# Altium schematic sheet IO.SchDoc
size A4; SheetNumber: 3; SheetTotal: 7
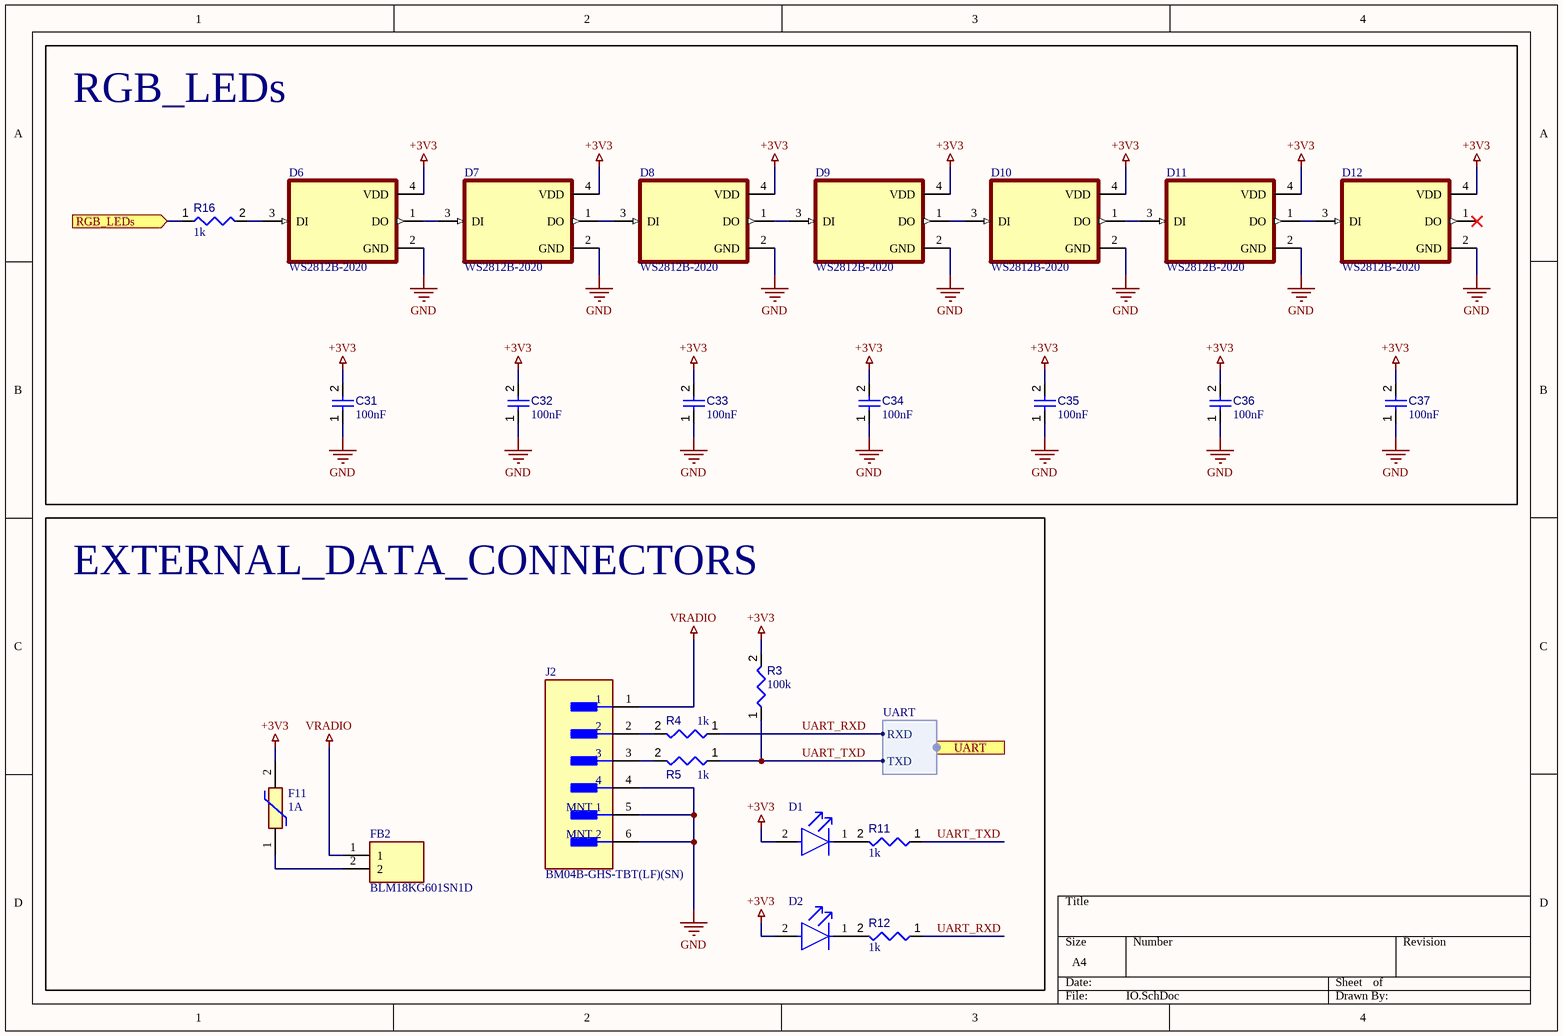
[diagram p0: IO.SchDoc]

## Parts
C31  value 100nF  [CAPC0402(1005)60_L]  (hidden comment: Capacitor 100nF +/-20% 10V 0402)
C32  value 100nF  [CAPC0402(1005)60_L]  (hidden comment: Capacitor 100nF +/-20% 10V 0402)
C33  value 100nF  [CAPC0402(1005)60_L]  (hidden comment: Capacitor 100nF +/-20% 10V 0402)
C34  value 100nF  [CAPC0402(1005)60_L]  (hidden comment: Capacitor 100nF +/-20% 10V 0402)
C35  value 100nF  [CAPC0402(1005)60_L]  (hidden comment: Capacitor 100nF +/-20% 10V 0402)
C36  value 100nF  [CAPC0402(1005)60_L]  (hidden comment: Capacitor 100nF +/-20% 10V 0402)
C37  value 100nF  [CAPC0402(1005)60_L]  (hidden comment: Capacitor 100nF +/-20% 10V 0402)
D1  (no value)  [FP-LTST-C191TBKT-MFG]
D2  (no value)  [FP-LTST-C191TBKT-MFG]
D6  WS2812B-2020  [LED_WS2812-2020]
D7  WS2812B-2020  [LED_WS2812-2020]
D8  WS2812B-2020  [LED_WS2812-2020]
D9  WS2812B-2020  [LED_WS2812-2020]
D10  WS2812B-2020  [LED_WS2812-2020]
D11  WS2812B-2020  [LED_WS2812-2020]
D12  WS2812B-2020  [LED_WS2812-2020]
F11  1A  [0402L010SLKR]
FB2  BLM18KG601SN1D  [BLM18EG121SH1D]
J2  BM04B-GHS-TBT(LF)(SN)  [FP-BM04B-GHS-TBT_LF_SN-MFG]
R3  value 100k  [RESC0402(1005)_L]  (hidden comment: Resistor 100K +/-1 % 0402 63 mW)
R4  value 1k  [RESC0402(1005)_L]  (hidden comment: Resistor 1K +/-5 % 0402 63 mW)
R5  value 1k  [RESC0402(1005)_L]  (hidden comment: Resistor 1K +/-5 % 0402 63 mW)
R11  value 1k  [RESC0402(1005)_L]  (hidden comment: Resistor 1K +/-5 % 0402 63 mW)
R12  value 1k  [RESC0402(1005)_L]  (hidden comment: Resistor 1K +/-5 % 0402 63 mW)
R16  value 1k  [RESC0402(1005)_L]  (hidden comment: Resistor 1K +/-5 % 0402 63 mW)

## Blocks framed on the sheet
RGB_LEDs: C31-C37 D6-D12 R16
EXTERNAL_DATA_CONNECTORS: D1 D2 F11 FB2 J2 R3-R5 R11 R12

## Ports
RGB_LEDs (in, see MAIN_BOARD[2B], MCU[3B]), UART (harness UART, see MAIN_BOARD[2C], MCU[3B])

## Harnesses
UART: RXD, TXD

## Nets
+3V3: C31.2 C32.2 C33.2 C34.2 C35.2 C36.2 C37.2 D1.2(A) D2.2(A) D6.4(VDD) D7.4(VDD) D8.4(VDD) D9.4(VDD) D10.4(VDD) D11.4(VDD) D12.4(VDD) F11.2 R3.2
GND: C31.1 C32.1 C33.1 C34.1 C35.1 C36.1 C37.1 D6.2(GND) D7.2(GND) D8.2(GND) D9.2(GND) D10.2(GND) D11.2(GND) D12.2(GND) J2.4 J2.5(MNT_1) J2.6(MNT_2)
VRADIO: FB2.1 J2.1
RGB_LEDs: R16.1 ; port RGB_LEDs
UART_RXD: R4.1 R12.1 ; port UART.RXD
UART_TXD: R3.1 R5.1 R11.1 ; port UART.TXD
NetD1_1: D1.1(C) R11.2
NetD2_1: D2.1(C) R12.2
NetD6_1: D6.1(DO) D7.3(DI)
NetD6_3: D6.3(DI) R16.2
NetD7_1: D7.1(DO) D8.3(DI)
NetD8_1: D8.1(DO) D9.3(DI)
NetD9_1: D9.1(DO) D10.3(DI)
NetD10_1: D10.1(DO) D11.3(DI)
NetD11_1: D11.1(DO) D12.3(DI)
NetF11_1: F11.1 FB2.2
NetJ2_2: J2.2 R4.2
NetJ2_3: J2.3 R5.2

Not connected (* = marked no-connect by the designer): D12 1(DO)*

## Library data of the parts
C31-C37 = CMP-001-00061-3: Chip Capacitor, 100nF +/-20%, 10V, 0402, Thickness 0.6 mm; Tolerance: 20%; Mounting Technology: SMT; Voltage Rating: 10V; Max Operating Temperature: 85°C; Pins: 2; Case/Package: 0402; Min Operating Temperature: -55°C
D1 D2 = CMP-22017-000008-1: LED BLUE CLEAR CHIP SMD; Lens Color: Colorless; Dominant Wavelength: 475nm; Forward Current: 20mA; Wavelength: 468nm; Viewing Angle: 130°; Power Dissipation: 76mW; Luminous Intensity: 180mcd; Reverse Voltage: 5V; Number of Elements: 1; Lens Style: Diffused; Forward Voltage: 3.8V; Max Power Dissipation: 75mW; Case Code (Metric): 1608; Packaging: Tape and Reel; Case/Package: 0603; Depth: 1.6mm; Mount: Surface Mount; Lead Free: Lead Free; Min Operating Temperature: -20°C; Lens Transparency: Clear; Illumination Color: Blue; Height: 0.55mm; Test Current: 20mA; Case Code (Imperial): 0603; Max Operating Temperature: 80°C; Number of Pins: 2; Length: 0.8mm; Radiation Hardening: No; Package Quantity: 1; Number of LEDs: 1; Width: 0.8mm; Color: Blue
D6-D12 = WS2812-2020: Intelligent control LED integrated light source; MF: {'manufacturer': u'Worldsemi'}; Availability: Unavailable; Value: *; Package: None; Price: None; MP: WS2812-2020
F11 = 0402L100SLKR: Resettable Fuse; Manufacturer_Name: LITTELFUSE; Datasheet Link: https://g.componentsearchengine.com/Datasheets/1/0402L010SLKR.pdf; Height: 0.6mm; Manufacturer_Part_Number: 0402L100SLKR; Mouser Part Number: 576-0402L100SLKR; Mouser Price/Stock: https://www.mouser.co.uk/ProductDetail/Littelfuse/0402L100SLKR?qs=7MVldsJ5Uay4EIwecFafFg%3D%3D
FB2 = BLM18KG601SN1D: Ferrite Bead; Manufacturer_Name: Murata Electronics; Datasheet Link: http://www.murata.com/~/media/webrenewal/support/library/catalog/products/emc/emifil/c31e.ashx?la=en-gb; Height: 0.95mm; Manufacturer_Part_Number: BLM18KG601SN1D; Mouser Part Number: 81-BLM18KG601SN1D; Mouser Price/Stock: https://www.mouser.co.uk/ProductDetail/Murata-Electronics/BLM18KG601SN1D?qs=rvfpa0%252BU10NPWIt745bDHg%3D%3D; Arrow Part Number: BLM18KG601SN1D; Arrow Price/Stock: https://www.arrow.com/en/products/blm18kg601sn1d/murata-manufacturing?region=nac
J2 = CMP-17439-000062-2: CONN HEADER SMD 4POS 1.25MM; Number of Positions: 4; Wire/Cable Gauge: 26AWG; Current Rating: 1A; Voltage Rating (AC): 50V; Gender: Male; Orientation: Straight; Max Operating Temperature: 85°C; Pitch: 1.25mm; Contact Plating: Tin; Number of Rows: 4; Series: GH; Min Operating Temperature: -25°C; REACH SVHC: No SVHC; Packaging: Cut Tape; Lead Free: Lead Free; Voltage Rating: 50V; Contact Material: Bronze; Number of Contacts: 4; Termination: Crimp; Case/Package: SMD/SMT; Housing Color: Natural; Housing Material: Nylon
R3 = CMP-009-00168-3: Chip Resistor, 100 kOhms, +/-1 %, 63 mW, -55 to 155 degC, 0402; Tolerance: 1%; Power: 63mW; Max Operating Temperature: 155°C; Min Operating Temperature: -55°C; Pins: 2; Case/Package: 0402
R4 R5 R11 R12 R16 = CMP-009-00157-3: Chip Resistor, 1 kOhms, +/-5 %, 63 mW, -55 to 155 degC, 0402; Tolerance: 5%; Power: 63mW; Case/Package: 0402; Pins: 2; Min Operating Temperature: -55°C; Max Operating Temperature: 155°C